# EAGLE schematic PCB0M8A3 (EAGLE 6.2)
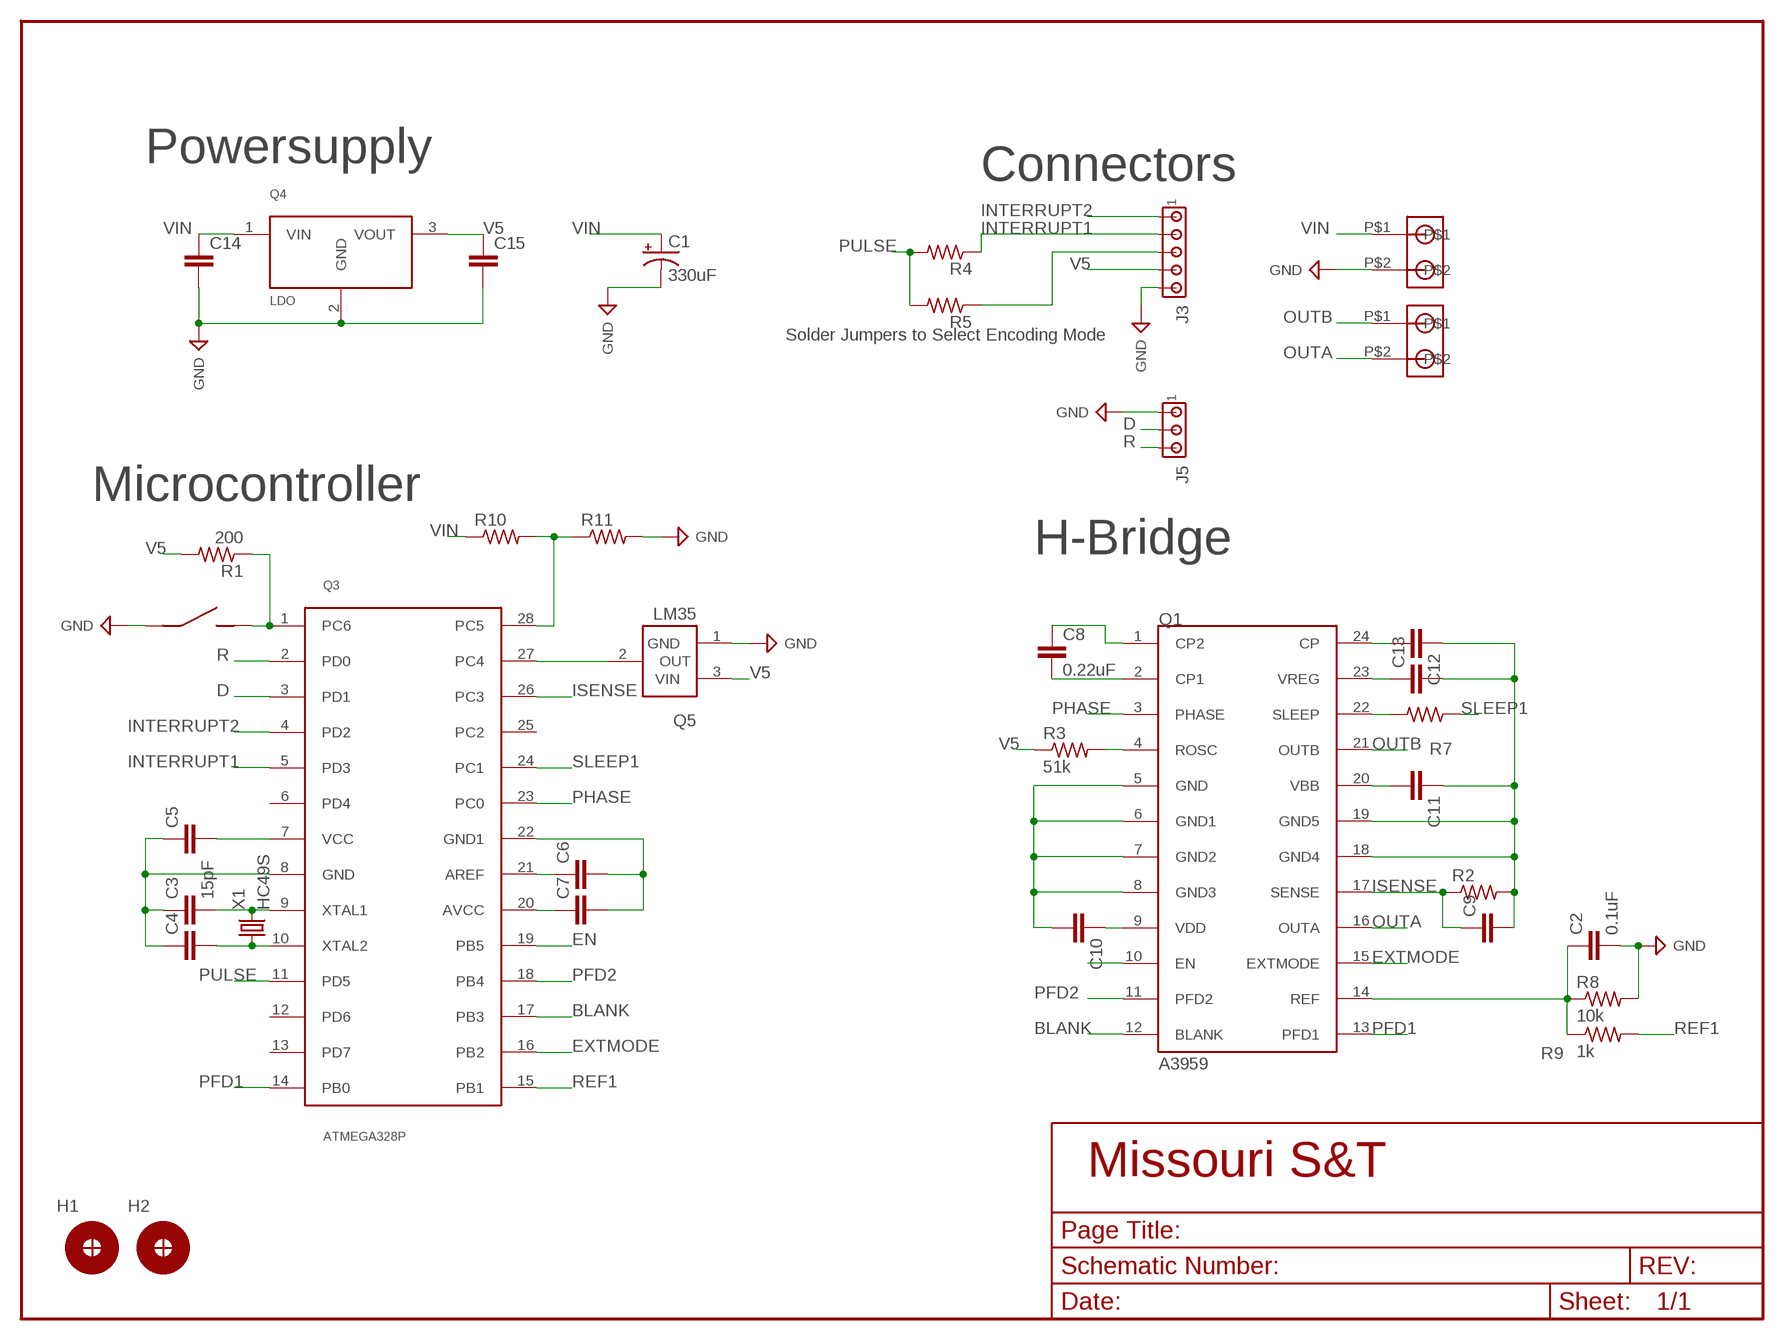
[diagram p0: schematic, sheet 1]

## Parts
C1  330uF  C_POL8MM  [C_8MM]
C2  0.1uF  C_CAP_0805  [C_0805]
C3  15pF  C_CAP_0805  [C_0805]
C4  C_CAP_0805  [C_0805]
C5  C_CAP_0805  [C_0805]
C6  C_CAP_0805  [C_0805]
C7  C_CAP_0805  [C_0805]
C8  0.22uF  C_CAP_0805  [C_0805]
C9  C_CAP_0805  [C_0805]
C10  C_CAP_0805  [C_0805]
C11  C_CAP_0805  [C_0805]
C12  C_CAP_0805  [C_0805]
C13  C_CAP_0805  [C_0805]
C14  C_CAP_0805  [C_0805]
C15  C_CAP_0805  [C_0805]
H1  H_MNTHOLE_#4  [H_MNTHOLE_#4]
H2  H_MNTHOLE_#4  [H_MNTHOLE_#4]
J1  J_1546074-2282834-2  [J_2.54MM]
J2  J_1546074-2282834-2  [J_2.54MM]
J3  J_MTA5P_100  [J_MTA100_5P]
J4  J_MC32857  [J_TOGGLE]
J5  J_MTA3P_100  [J_MTA100_3P]
Q1  A3959  Q_A3959  [DIP24]
Q3  ATMEGA328P  Q_ATMEGA328P  [DIP28]
Q4  LDO  Q_LDO  [TO-220]
Q5  LM35  Q_LM35  [TO-92-3]
R1  200  R_RES_0805  [R_0805]
R2  R_RES_2010  [R_2010]
R3  51k  R_RES_0805  [R_0805]
R4  R_RES_0603  [R_0603]
R5  R_RES_0603  [R_0603]
R7  R_1/4WL  [R_1/4WL]
R8  10k  R_RES_0805  [R_0805]
R9  1k  R_RES_0805  [R_0805]
R10  R_RES_0805  [R_0805]
R11  R_RES_0805  [R_0805]
X1  HC49S  X_HC49SCRYSTAL  [HC-49]

## Nets
BLANK: Q1.12(BLANK) Q3.17(PB3)
D: J5.2 Q3.3(PD1)
EN: Q1.10(EN) Q3.19(PB5)
EXTMODE: Q1.15(EXTMODE) Q3.16(PB2)
GND: C1.- C2.2 C3.1 C4.1 C5.1 C6.2 C7.2 C9.2 C10.2 C11.1 C12.1 C13.2 C14.2 C15.2 J1.P$2 J3.5 J4.P$1 J5.1 Q1.5(GND) Q1.6(GND1) Q1.7(GND2) Q1.8(GND3) Q1.18(GND4) Q1.19(GND5) Q3.8(GND) Q3.22(GND1) Q4.2(GND) Q5.1(GND) R2.2 R8.2 R11.2 ; supply symbol labelled SUP_GND
INTERRUPT1: J3.2 Q3.5(PD3) R4.1
INTERRUPT2: J3.1 Q3.4(PD2)
ISENSE: C9.1 Q1.17(SENSE) Q3.26(PC3) R2.1
N$1: C4.2 Q3.10(XTAL2) X1.P$1
N$2: C3.2 Q3.9(XTAL1) X1.P$2
N$3: Q1.22(SLEEP) R7.2
N$4: Q3.27(PC4) Q5.2(OUT)
N$5: Q3.28(PC5) R10.2 R11.1
N$6: C6.1 Q3.21(AREF)
N$7: J3.3 R5.1
N$8: J4.P$2 Q3.1(PC6) R1.1
N$9: C8.1 Q1.1(CP2)
N$10: C8.2 Q1.2(CP1)
N$13: Q1.4(ROSC) R3.2
N$19: C12.2 Q1.24(CP)
N$21: C13.1 Q1.23(VREG)
OUTA: J2.P$2 Q1.16(OUTA)
OUTB: J2.P$1 Q1.21(OUTB)
PFD1: Q1.13(PFD1) Q3.14(PB0)
PFD2: Q1.11(PFD2) Q3.18(PB4)
PHASE: Q1.3(PHASE) Q3.23(PC0)
PULSE: Q3.11(PD5) R4.2 R5.2
R: J5.3 Q3.2(PD0)
REF: C2.1 Q1.14(REF) R8.1 R9.1
REF1: Q3.15(PB1) R9.2
SLEEP1: Q3.24(PC1) R7.1
V5: C5.2 C7.1 C10.1 C15.1 J3.4 Q1.9(VDD) Q3.7(VCC) Q3.20(AVCC) Q4.3(VOUT) Q5.3(VIN) R1.2 R3.1
VIN: C1.+ C11.2 C14.1 J1.P$1 Q1.20(VBB) Q4.1(VIN) R10.1
Unconnected: H1.1 H2.1 Q3.6(PD4) Q3.12(PD6) Q3.13(PD7) Q3.25(PC2)

## Notes on the sheet
- Powersupply
- Connectors
- Solder Jumpers to Select Encoding Mode
- Microcontroller
- H-Bridge

## Library data of the parts
C1 = PCB0M1:C_POL: Alum Elect. Cap with 10mm diameter, 5mm lead spacing and 0.7mm lead diameter
C2-C15 = Lib_Passive:C_CAP
H1 H2 = Lib_TH:H_MNTHOLE
J1 J2 = PCB0M1:J_1546074-2
J3 = Lib_TH:J_MTA5P
J4 = PCB0M1:J_MC32857: SWITCH, TACTILE, SPST-NO, 50mA, THD
J5 = Lib_TH:J_MTA3P
Q1 = PCB0M1:Q_A3959: Full Bridge Peak Current mode controll driver
Q3 = PCB0M1:Q_ATMEGA328P: ATMEGA 328P in 28PIN PDIP package
Q4 = PCB0M1:Q_LDO: LDO with fixed ouput voltage
Q5 = PCB0M1:Q_LM35: IC, TEMPERATURE SENSOR, 0.4°C, TO-92-3
R1-R5 R8-R11 = Lib_Passive:R_RES
R7 = PCB0M1:R_1/4WL: Standard 1/4W resistor package that has long leads to bridge traces
X1 = PCB0M1:X_HC49SCRYSTAL: CRYSTAL METAL CAN, 16MHZ, 18PF, HC-49/US